# EAGLE design capacitor-tester_v0.0.1 (EAGLE 9.6.0)
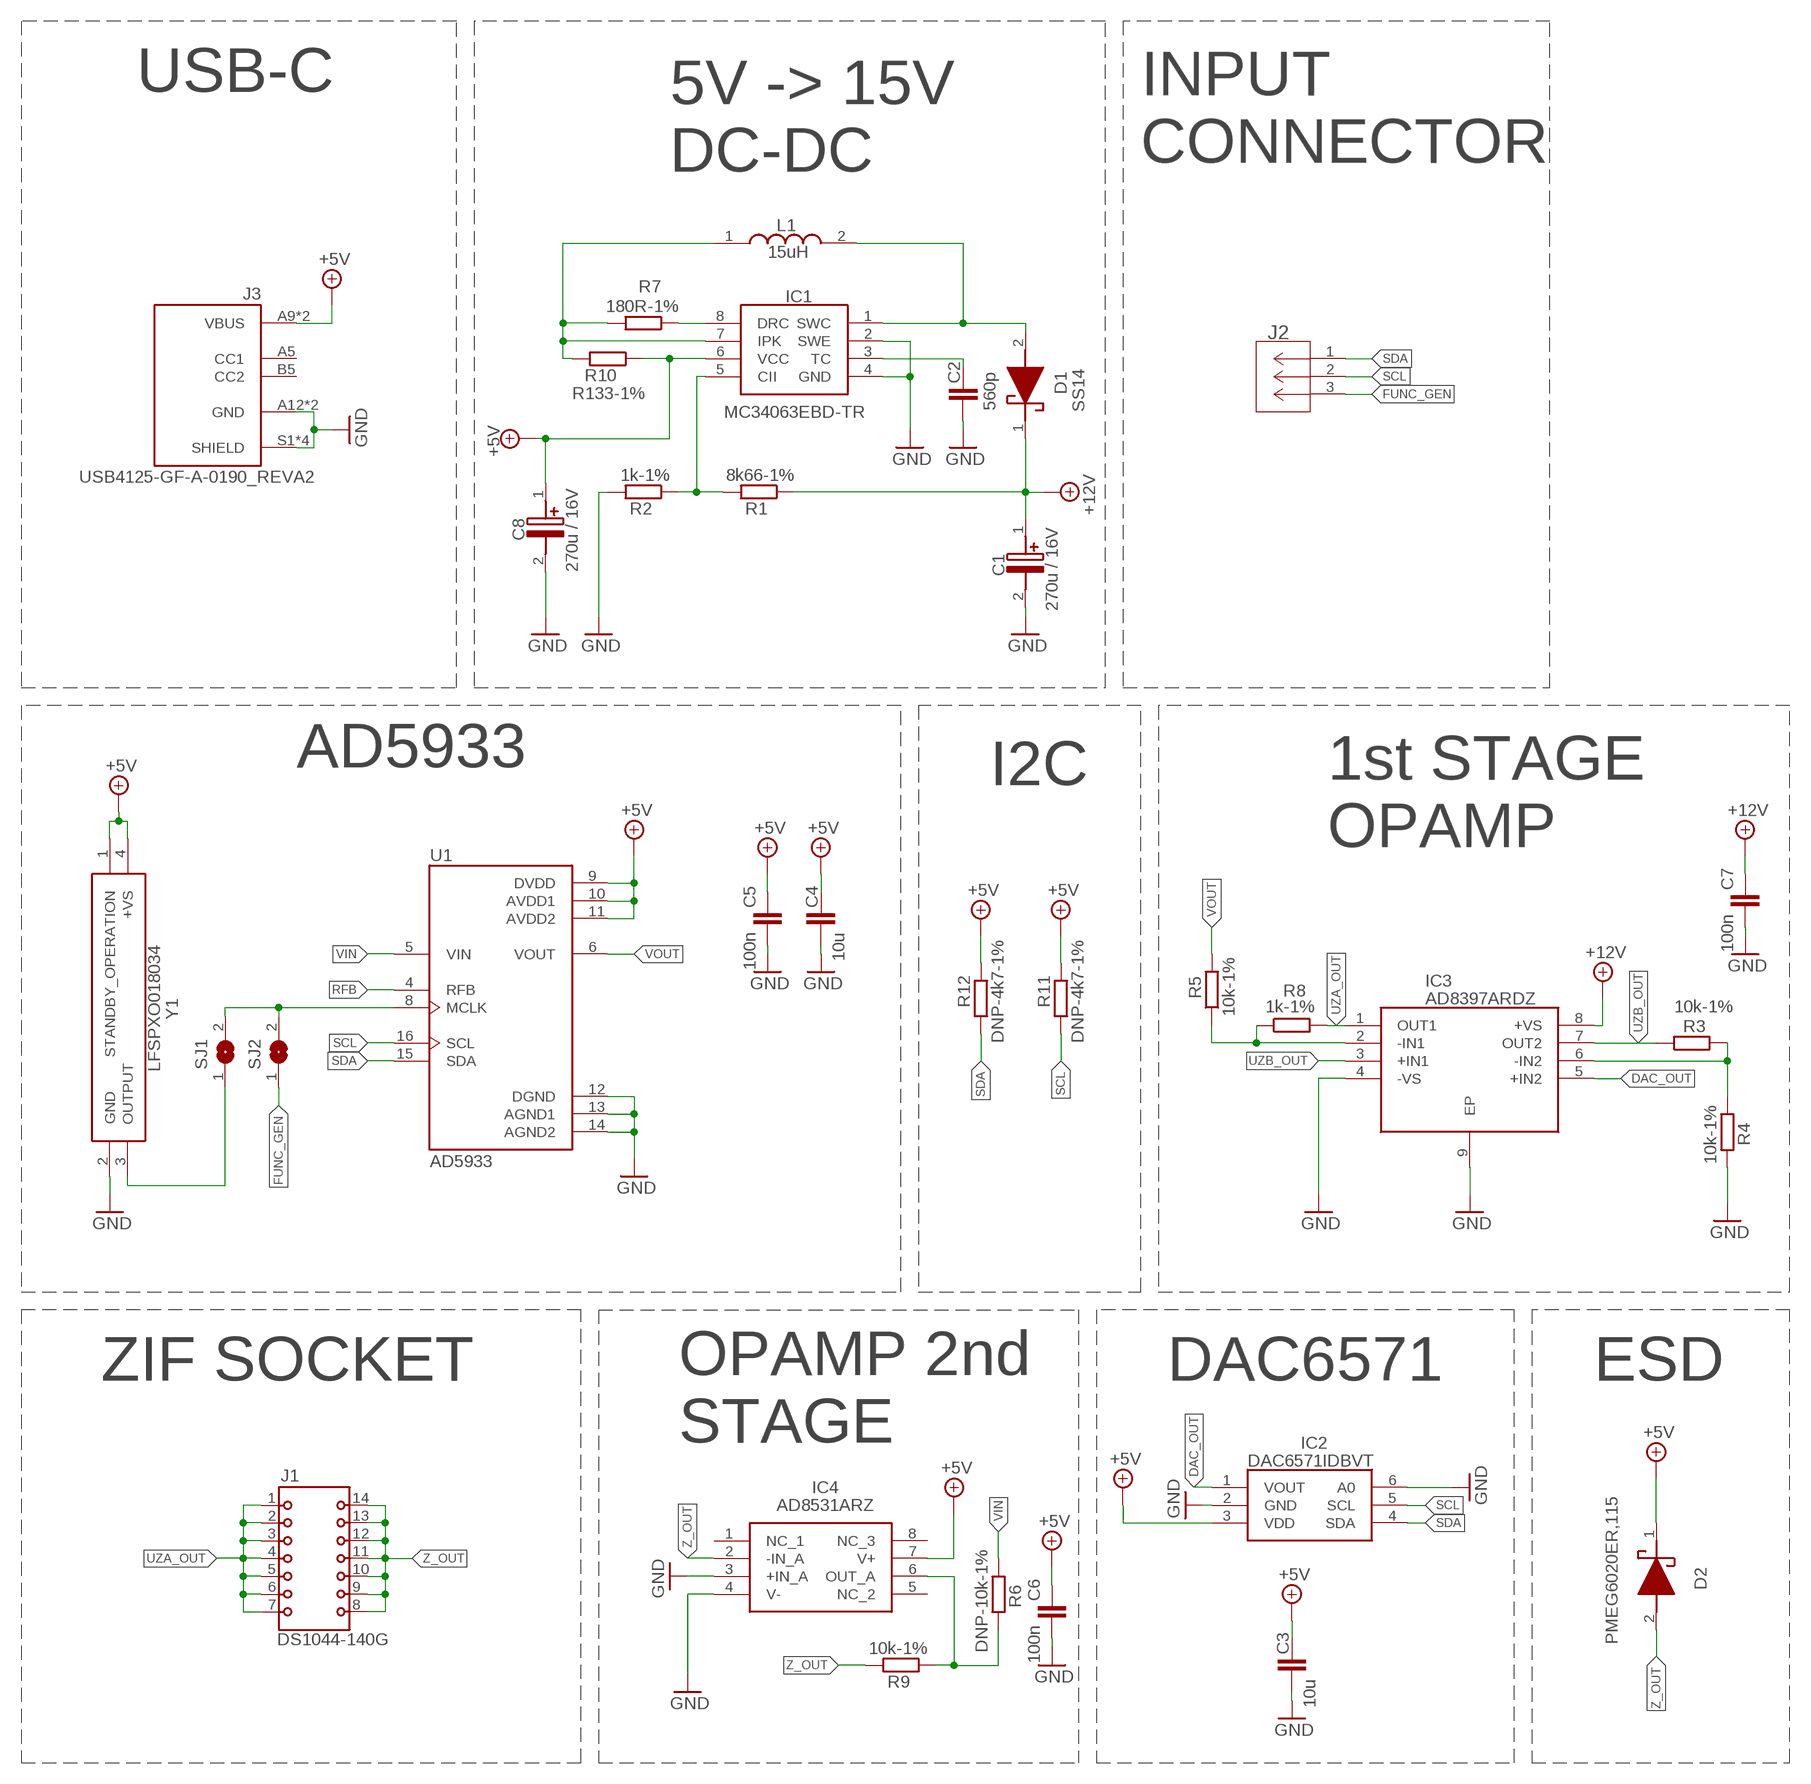
[diagram p0: schematic, sheet 1]

## Parts
C1  270u / 16V  EEEFKC271XSP  [EEE0JA331XP]
C2  560p  CAPACITOR_SMD_CERAMIC0603  [C0603]
C3  10u  CAPACITOR_SMD_CERAMIC0603  [C0603]
C4  10u  CAPACITOR_SMD_CERAMIC0603  [C0603]
C5  100n  CAPACITOR_SMD_CERAMIC0603  [C0603]
C6  100n  CAPACITOR_SMD_CERAMIC0603  [C0603]
C7  100n  CAPACITOR_SMD_CERAMIC0603  [C0603]
C8  270u / 16V  EEEFKC271XSP  [EEE0JA331XP]
D1  SS14  [DIOM5227X270N]
D2  PMEG6020ER,115  [PMEG6020ER115]
IC1  MC34063EBD-TR  [SOIC127P600X175-8N]
IC2  DAC6571IDBVT  [SOT95P280X145-6N]
IC3  AD8397ARDZ  [SOIC127P600X175-9N]
IC4  AD8531ARZ  [SOIC127P600X175-8N]
J1  DS1044-140G  [CONNFLY_DS1044-140G]
J2  250-103  [CONN3_250-103_WAG]
J3  USB4125-GF-A-0190_REVA2  [GCT_USB4125-GF-A-0190_REVA2]
L1  15uH  SDR0604-150YL  [SDR0604330KL]
R1  8k66-1%  RESISTOR_SMD0603  [R0603]
R2  1k-1%  RESISTOR_SMD0603  [R0603]
R3  10k-1%  RESISTOR_SMD0603  [R0603]
R4  10k-1%  RESISTOR_SMD0603  [R0603]
R5  10k-1%  RESISTOR_SMD0603  [R0603]
R6  DNP-10k-1%  RESISTOR_SMD0603  [R0603]
R7  180R-1%  RESISTOR_SMD0603  [R0603]
R8  1k-1%  RESISTOR_SMD0603  [R0603]
R9  10k-1%  RESISTOR_SMD0603  [R0603]
R10  R133-1%  RESISTOR_SMD0603  [R0603]
R11  DNP-4k7-1%  RESISTOR_SMD0603  [R0603]
R12  DNP-4k7-1%  RESISTOR_SMD0603  [R0603]
SJ1  SJW  [SJW]
SJ2  SJW  [SJW]
U1  AD5933  [SOP65P780X200-16N]
Y1  LFSPXO018034  [LFSPXO018034]

## Nets
+5V: C3.1 C4.1 C5.1 C6.1 C8.1(+) D2.1(K) IC1.6(VCC) IC2.3(VDD) IC4.7(V+) J3.A9(VBUS) J3.B9(VBUS) R10.1 R11.2 R12.2 U1.9(DVDD) U1.10(AVDD1) U1.11(AVDD2) Y1.1(STANDBY_OPERATION) Y1.4(+VS)
+12V: C1.1(+) C7.1 D1.1(K) IC3.8(+VS) R1.1
DAC_OUT: IC2.1(VOUT) IC3.5(+IN2)
FUNC_GEN: J2.3 SJ2.1
GND: C1.2(-) C2.2 C3.2 C4.2 C5.2 C6.2 C7.2 C8.2(-) IC1.2(SWE) IC1.4(GND) IC2.2(GND) IC2.6(A0) IC3.4(-VS) IC3.9(EP) IC4.3(+IN_A) IC4.4(V-) J3.A12(GND) J3.B12(GND) J3.S1(SHIELD) J3.S2(SHIELD) J3.S3(SHIELD) J3.S4(SHIELD) R2.2 R4.2 U1.12(DGND) U1.13(AGND1) U1.14(AGND2) Y1.2(GND)
MCLK: SJ1.1 Y1.3(OUTPUT)
N$1: IC4.6(OUT_A) R6.2 R9.1
N$4: IC3.2(-IN1) R5.1 R8.1
N$5: D1.2(A) IC1.1(SWC) L1.2
N$6: SJ1.2 SJ2.2 U1.8(MCLK)
N$7: IC1.5(CII) R1.2 R2.1
N$8: IC1.8(DRC) R7.1
N$10: C2.1 IC1.3(TC)
N$11: IC1.7(IPK) L1.1 R7.2 R10.2
N$13: IC3.6(-IN2) R3.2 R4.1
RFB: U1.4(RFB)
SCL: IC2.5(SCL) J2.2 R11.1 U1.16(SCL)
SDA: IC2.4(SDA) J2.1 R12.1 U1.15(SDA)
UZA_OUT: IC3.1(OUT1) J1.1 J1.2 J1.3 J1.4 J1.5 J1.6 J1.7 R8.2
UZB_OUT: IC3.3(+IN1) IC3.7(OUT2) R3.1
VIN: R6.1 U1.5(VIN)
VOUT: R5.2 U1.6(VOUT)
Z_OUT: D2.2(A) IC4.2(-IN_A) J1.8 J1.9 J1.10 J1.11 J1.12 J1.13 J1.14 R9.2
Unconnected: IC4.1(NC_1) IC4.5(NC_2) IC4.8(NC_3) J3.A5(CC1) J3.B5(CC2)

## Notes on the sheet
- USB-C
- INPUT
  CONNECTOR
- 5V -> 15V 
  DC-DC
- AD5933 | I2C
- 1st STAGE
  OPAMP
- ZIF SOCKET | DAC6571 | ESD
- OPAMP 2nd 
  STAGE

## Library data of the parts
C1 C8 = EEEFKC271XSP:EEEFKC271XSP: Panasonic 270uF 16 V dc Aluminium Electrolytic Capacitor, FKS Series 2000h 6.3 (Dia.) x 7.7mm Source: Datasheet <http://industrial.panasonic.com/cdbs/www-data/pdf/RDE0000/ABA0000C1251.pdf>; DESCRIPTION: Panasonic 270uF 16 V dc Aluminium Electrolytic Capacitor, FKS Series 2000h 6.3 (Dia.) x 7.7mm; HEIGHT: 7.8mm; MANUFACTURER_NAME: Panasonic; MANUFACTURER_PART_NUMBER: EEEFKC271XSP
C2-C7 = custom_library:CAPACITOR_SMD_CERAMIC
D1 = SS14:SS14: High-Current Capability, Low VF; Glass-Passivated Junctions Source: Datasheet <https://www.onsemi.com/pub/Collateral/SS19-D.PDF>; DESCRIPTION: High-Current Capability, Low VF; Glass-Passivated Junctions; HEIGHT: 2.7mm; MANUFACTURER_NAME: onsemi; MANUFACTURER_PART_NUMBER: SS14; MOUSER_PART_NUMBER: 512-SS14; MOUSER_PRICE-STOCK: https://www.mouser.co.uk/ProductDetail/onsemi-Fairchild/SS14?qs=mVVXn4M53U%252BvrBaFv5vr4w%3D%3D
D2 = PMEG6020ER_115:PMEG6020ER,115: Nexperia PMEG6020ER,115 SMT Schottky Diode, 60V 2A, 2-Pin SOD-123W Source: Datasheet <https://assets.nexperia.com/documents/data-sheet/PMEG6020ER.pdf>; DESCRIPTION: Nexperia PMEG6020ER,115 SMT Schottky Diode, 60V 2A, 2-Pin SOD-123W; HEIGHT: 1.1mm; MANUFACTURER_NAME: Nexperia; MANUFACTURER_PART_NUMBER: PMEG6020ER,115
IC1 = MC34063EBD-TR:MC34063EBD-TR: DC-DC Converter Control Circuit SOIC8 STMicroelectronics MC34063EBD-TR, Step Down, Step Up, Voltage Inverting DC-DC Converter, 1.5A, Adjustable Source: Datasheet <https://datasheet.datasheetarchive.com/originals/distributors/Datasheets-5/DSA-98626.pdf>; DESCRIPTION: DC-DC Converter Control Circuit SOIC8 STMicroelectronics MC34063EBD-TR, Step Down, Step Up, Voltage Inverting DC-DC Converter, 1.5A, Adjustable; HEIGHT: 1.75mm; MANUFACTURER_NAME: STMicroelectronics; MANUFACTURER_PART_NUMBER: MC34063EBD-TR
IC2 = DAC6571IDBVT:DAC6571IDBVT: Texas Instruments DAC6571IDBVT, 10 bit Serial DAC, 188ksps, 6-Pin SOT-23 Source: Datasheet <http://www.ti.com/lit/gpn/dac6571>; DESCRIPTION: Texas Instruments DAC6571IDBVT, 10 bit Serial DAC, 188ksps, 6-Pin SOT-23; HEIGHT: 1.45mm; MANUFACTURER_NAME: Texas Instruments; MANUFACTURER_PART_NUMBER: DAC6571IDBVT; MOUSER_PART_NUMBER: 595-DAC6571IDBVT; MOUSER_PRICE-STOCK: https://www.mouser.co.uk/ProductDetail/Texas-Instruments/DAC6571IDBVT?qs=vul0MlC%2Fa1dqpnhoFf%252B88g%3D%3D
IC3 = AD8397ARDZ:AD8397ARDZ: Rail-to-Rail, High Output Current Amplifier Source: Datasheet <https://www.analog.com/AD8397/datasheet>; DESCRIPTION: Rail-to-Rail, High Output Current Amplifier; HEIGHT: 1.75mm; MANUFACTURER_NAME: Analog Devices; MANUFACTURER_PART_NUMBER: AD8397ARDZ; MOUSER_PART_NUMBER: 584-AD8397ARDZ; MOUSER_PRICE-STOCK: https://www.mouser.co.uk/ProductDetail/Analog-Devices/AD8397ARDZ?qs=%2FtpEQrCGXCzWQPMackckTA%3D%3D
IC4 = AD8531ARZ:AD8531ARZ: 250 mA Output, Low Cost, Single-Supply Amplifier Source: Datasheet <https://www.analog.com/AD8531/datasheet>; DESCRIPTION: 250 mA Output, Low Cost, Single-Supply Amplifier; HEIGHT: 1.75mm; MANUFACTURER_NAME: Analog Devices; MANUFACTURER_PART_NUMBER: AD8531ARZ; MOUSER_PART_NUMBER: 584-AD8531ARZ; MOUSER_PRICE-STOCK: https://www.mouser.co.uk/ProductDetail/Analog-Devices/AD8531ARZ?qs=%2FtpEQrCGXCxqCqynf0JWOw%3D%3D
J1 = DS1044-140G:DS1044-140G: Check availability <https://pricing.snapeda.com/parts/DS1044-140G/Connfly/view-part?ref=eda>; AVAILABILITY: Not in stock; CHECK_PRICES: https://www.snapeda.com/parts/DS1044-140G/Connfly/view-part/?ref=eda; DESCRIPTION: Socket: DIP; ZIF; PIN: 14; 7.62mm; demountable; -40÷105°C; THT; 50VDC; MF: Connfly; MP: DS1044-140G; PACKAGE: None; PRICE: None; SNAPEDA_LINK: https://www.snapeda.com/parts/DS1044-140G/Connfly/view-part/?ref=snap
J2 = custom_library:250-103; COPYRIGHT: Copyright (C) 2025 Ultra Librarian. All rights reserved.; MANUFACTURER_PART_NUMBER: 250-103; MFR_NAME: Wago
J3 = USB-C-6Pin:USB4125-GF-A-0190_REVA2: Check availability <https://pricing.snapeda.com/parts/USB4125-GF-A-0190/Global%20Connector%20Technology/view-part?ref=eda>; AVAILABILITY: In Stock; CHECK_PRICES: https://www.snapeda.com/parts/USB4125-GF-A-0190/Global+Connector+Technology/view-part/?ref=eda; DESCRIPTION: USB-C (USB TYPE-C) USB 2.0 Receptacle Connector 24 (6+18 Dummy) Position Surface Mount, Right Angle; Through Hole; MF: Global Connector Technology; MP: USB4125-GF-A-0190; PACKAGE: None; PRICE: None; SNAPEDA_LINK: https://www.snapeda.com/parts/USB4125-GF-A-0190/Global+Connector+Technology/view-part/?ref=snap
L1 = SDR0604-150YL:SDR0604-150YL: Bourns SDR0604 Series Wire-wound SMD Inductor with a Ferrite Core, 15 uH +/-15% 1.6A Idc Q:30 Source: Datasheet <https://www.bourns.com/docs/Product-Datasheets/SDR0604.pdf>; DESCRIPTION: Bourns SDR0604 Series Wire-wound SMD Inductor with a Ferrite Core, 15 uH +/-15% 1.6A Idc Q:30; HEIGHT: 4.8mm; MANUFACTURER_NAME: Bourns; MANUFACTURER_PART_NUMBER: SDR0604-150YL
R1-R12 = custom_library:RESISTOR_SMD
SJ1 SJ2 = jumper:SJ: SMD solder JUMPER
U1 = AD5933:AD5933: Check availability <https://pricing.snapeda.com/parts/AD5933/Analog%20Devices%2C%20Inc./view-part?ref=eda>; AVAILABILITY: Not in stock; CHECK_PRICES: https://www.snapeda.com/parts/AD5933/Analog+Devices/view-part/?ref=eda; DESCRIPTION: Direct Digital Synthesizer 16.776MHz 1-DAC 12bit Serial (I2C) 16-Pin SSOP Tube; MF: Analog Devices, Inc.; MP: AD5933; PACKAGE: SSOP-16 Analog Devices; PRICE: None; SNAPEDA_LINK: https://www.snapeda.com/parts/AD5933/Analog+Devices/view-part/?ref=snap
Y1 = LFSPXO018034:LFSPXO018034: IQD FREQUENCY PRODUCTS - LFSPXO018034 - CRYSTAL OSCILLATOR, SMD, 16MHZ Source: Datasheet <https://www.iqdfrequencyproducts.com/products/pn/LFSPXO018034Bulk.pdf>; DESCRIPTION: IQD FREQUENCY PRODUCTS - LFSPXO018034 - CRYSTAL OSCILLATOR, SMD, 16MHZ; HEIGHT: 1.4mm; MANUFACTURER_NAME: IQD; MANUFACTURER_PART_NUMBER: LFSPXO018034; MOUSER_PART_NUMBER: 449-LFSPXO018034; MOUSER_PRICE-STOCK: https://www.mouser.co.uk/ProductDetail/IQD/LFSPXO018034?qs=ZcfC38r4Povaz%2FiRuMxZiQ%3D%3D

## Board
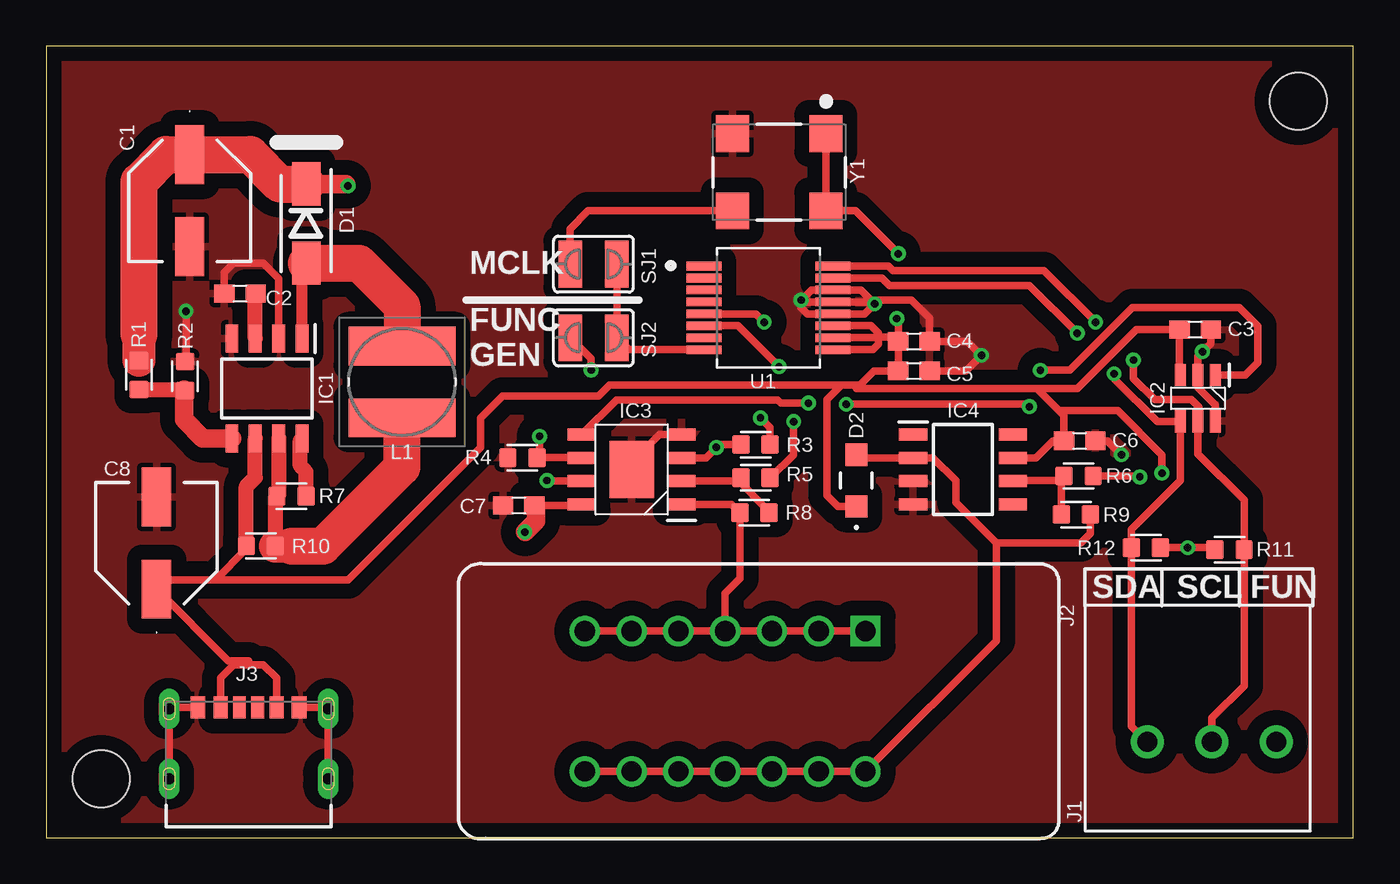
[diagram p1: board, top side]
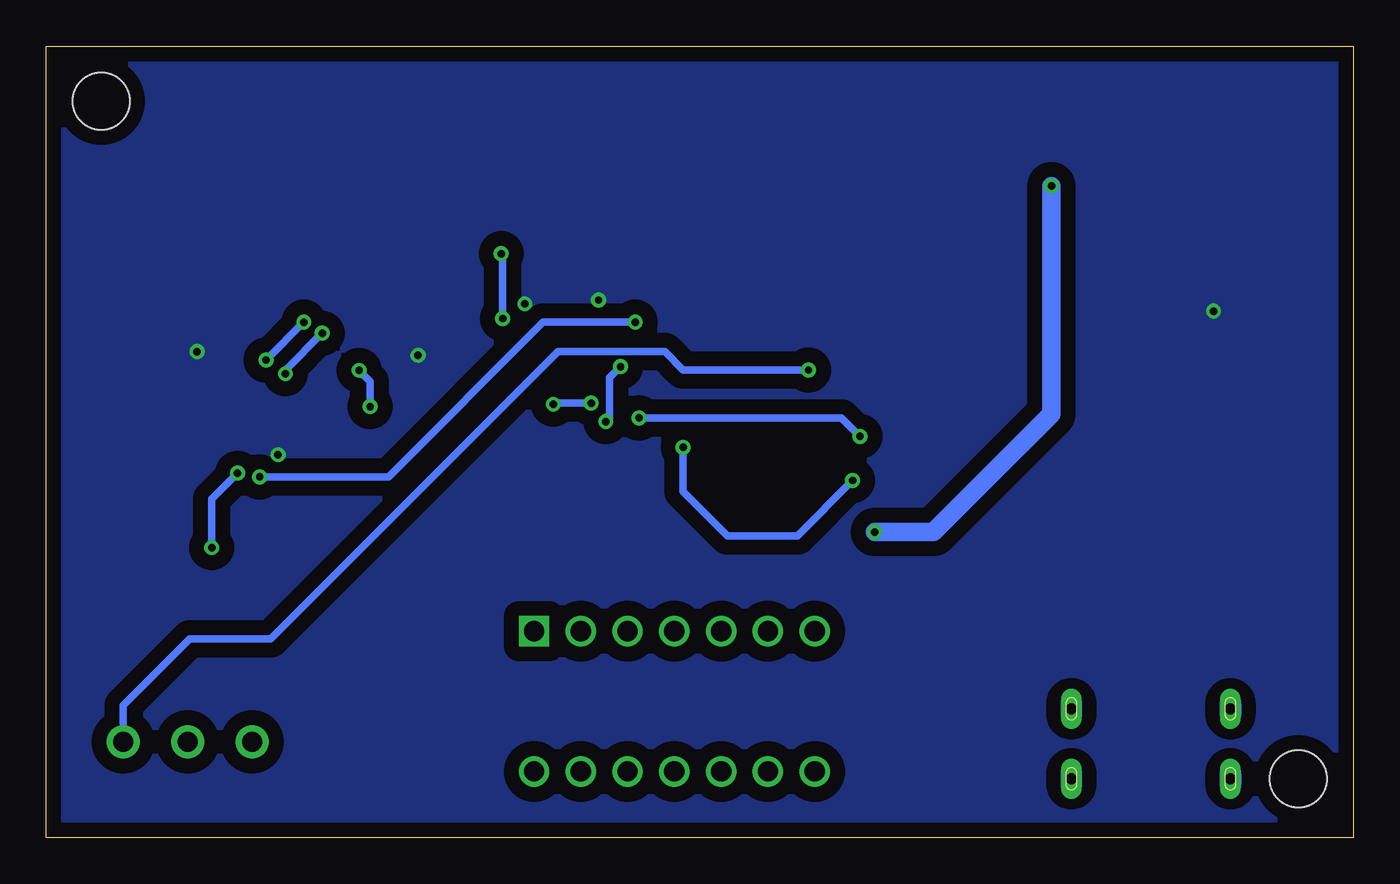
[diagram p2: board, bottom side, seen from below]

Size 71 x 43 mm. Coordinates in mm from the lower left corner, seen from the top.
Outline: 0,0 71,0 71,43 0,43 0,0
Copper layers (1*16): Top 0.035mm / dielectric 1.5mm / Bottom 0.035mm
Design rules "DRC *": minimum track width 0.4mm, minimum drill 0.3mm, track to track 8mil, track to pad 8mil, pad to pad 8mil, via to via 8mil, smd to smd 8mil, copper to edge 20mil, drill to drill 8mil, minimum pad ring 10mil, minimum via ring 8mil, stop-mask expansion 4mil, vias tented up to drill 200mil, thermal gap 10mil
Holes 3.1 mm at 3,3.2 68,40

### Footprints (pad centres in the part's own frame; a part is rotated, then mirrored left to right if it is on the bottom)
EEE0JA331XP = smd 3.2 x 1.6: 1 -2.5,0; 2 2.5,0
C0603 = smd 1.1 x 1: 1 -0.85,0; 2 0.85,0
DIOM5227X270N = smd 2.35 x 1.55: 1 -2.15,0; 2 2.15,0
PMEG6020ER115 = smd 1.2 x 1.2: 1 -1.4,0; 2 1.4,0
SOIC127P600X175-8N = smd 1.525 x 0.7: 1 -2.712,1.905; 2 -2.712,0.635; 3 -2.712,-0.635; 4 -2.712,-1.905; 5 2.712,-1.905; 6 2.712,-0.635; 7 2.712,0.635; 8 2.712,1.905
SOT95P280X145-6N = smd 1.2 x 0.6: 1 -1.25,0.95; 2 -1.25,0; 3 -1.25,-0.95; 4 1.25,-0.95; 5 1.25,0; 6 1.25,0.95
SOIC127P600X175-9N = smd 1.525 x 0.65: 1 -2.712,1.905; 2 -2.712,0.635; 3 -2.712,-0.635; 4 -2.712,-1.905; 5 2.712,-1.905; 6 2.712,-0.635; 7 2.712,0.635; 8 2.712,1.905 | smd 2.41 x 3.098: 9 0,0
SOIC127P600X175-8N' = smd 1.525 x 0.65: 1 -2.712,1.905; 2 -2.712,0.635; 3 -2.712,-0.635; 4 -2.712,-1.905; 5 2.712,-1.905; 6 2.712,-0.635; 7 2.712,0.635; 8 2.712,1.905
CONNFLY_DS1044-140G = drill 1.1 square: 1 -3.81,7.62 | drill 1.1: 2 -3.81,5.08; 3 -3.81,2.54; 4 -3.81,0; 5 -3.81,-2.54; 6 -3.81,-5.08; 7 -3.81,-7.62; 8 3.81,-7.62; 9 3.81,-5.08; 10 3.81,-2.54; 11 3.81,0; 12 3.81,2.54; 13 3.81,5.08; 14 3.81,7.62
CONN3_250-103_WAG = drill 1.092 pad 1.803: 1 0,0; 2 3.505,0; 3 7.01,0
GCT_USB4125-GF-A-0190_REVA2 = smd 0.7 x 1.2: A5 -0.5,3.08; B5 0.5,3.08 | smd 0.76 x 1.2: A9 1.52,3.08; B9 -1.52,3.08 | smd 0.8 x 1.2: A12 2.75,3.08; B12 -2.75,3.08 | drill 0.6 pad 0.8 long: S1 -4.32,3; S2 4.32,3; S3 -4.32,-0.8; S4 4.32,-0.8
SDR0604330KL = smd 5.8 x 2.1: 1 0,-1.95; 2 0,1.95
R0603 = smd 0.94 x 1.02: 1 -0.79,0; 2 0.79,0
SJW = smd 1.27 x 2.54: 1 -1.27,0; 2 1.27,0
SOP65P780X200-16N = smd 1.9 x 0.48: 1 -3.505,2.275; 2 -3.505,1.625; 3 -3.505,0.975; 4 -3.505,0.325; 5 -3.505,-0.325; 6 -3.505,-0.975; 7 -3.505,-1.625; 8 -3.505,-2.275; 9 3.505,-2.275; 10 3.505,-1.625; 11 3.505,-0.975; 12 3.505,-0.325; 13 3.505,0.325; 14 3.505,0.975; 15 3.505,1.625; 16 3.505,2.275
LFSPXO018034 = smd 1.8 x 2: 1 -2.54,-2.1; 2 2.54,-2.1; 3 2.54,2.1; 4 -2.54,2.1

### Placement (x,y rotation side)
C1  7.8,34.6 270 top
C2  10.53,29.55 180 top
C3  62.4,27.6 0 top
C4  47.13,26.95 0 top
C5  47.13,25.35 0 top
C6  56.13,21.55 0 top
C7  25.67,18.05 180 top
C8  6,16 90 top
D1  14.13,33.35 270 top
D2  44,19.4 90 top
IC1  12,24.4 270 top
IC2  62.55,23.87 270 top
IC3  31.8,20 180 top
IC4  AD8531ARZ  [SOIC127P600X175-8N']  49.8,20 0 top
J1  36.88,7.41 270 top
J2  59.8,5.2 0 top
J3  11,4 0 top
L1  19.33,24.75 0 top
R1  5.05,25.13 270 top
R2  7.55,25.07 90 top
R3  38.53,21.35 0 top
R4  25.87,20.65 180 top
R5  38.53,19.55 0 top
R6  56.07,19.65 180 top
R7  13.33,18.55 180 top
R8  38.47,17.65 180 top
R9  55.93,17.55 0 top
R10  11.67,15.85 0 top
R11  64.27,15.65 180 top
R12  59.73,15.75 0 top
SJ1  29.73,31.15 0 top
SJ2  29.73,27.15 0 top
U1  39.23,28.78 0 top
Y1  39.81,36.15 180 top

### Tracks (layer width: path | path; a pad name or v marks a point on that pad's centre or on a via)
+5V  (via drill 0.4 pad 0.5)
  Top 0.4: R12.2 v62,15.75 63.48,15.75 R11.2
  Top 0.406: J3.B9 9.48,8.68 10.2,9.4 10.8,9.4 | J3.A9 12.52,8.68 11.8,9.4 10.8,9.4 | 10.8,9.4 11,9.6 9.9,9.6 C8.1 6.5,14 9.2,14 | 9.2,14 10.88,15.68 R10.1 | Y1.1 Y1.4 43.95,34.05 v46.28,31.72 | 9.2,14 16.4,14 23.6,21.2 23.6,22.8 24.8,24 30,24 30.6,24.6 43.2,24.6 | 43.2,24.6 44.2,24.6 | 44.2,24.6 44,24.4 53.8,24.4 | 44.2,24.6 44.95,25.35 C5.1 C4.1 | U1.9 44.9,26.5 45.2,26.8 45.2,27.2 | 45.2,27.2 46.03,27.2 C4.1 | 45.2,27.2 45.2,27.4 44.8,27.8 U1.11 | U1.10 45.15,27.15 45.2,27.2 | IC4.7 53.76,20.64 54.68,21.55 C6.1 55.28,22.92 55,23.2 | IC2.3 61.55,25.17 C3.1 59.2,27.6 56,24.4 53.8,24.4 | D2.1 43,18 42.4,18.6 42.4,23.8 43.2,24.6 | 53.8,24.4 55,23.2 | C4.1 46.28,28.12 v46.2,28.2 | 55,23.2 58.2,23.2 60.6,20.8 v60.6,19.8
  Top 0.813: R10.1 10.88,19.08 11.37,19.57 IC1.6
  Bottom 0.4: v60.6,19.8 62,18.4 v62,15.75
  Bottom 0.406: v46.2,28.2 46.2,31.64 v46.28,31.72
+12V  (via drill 0.4 pad 0.5)
  Top 0.406: 26.6,17.93 26.52,18.01 C7.1 29.04,18.05 IC3.8 | 16.3,35.5 v16.4,35.4
  Top 1.016: 26.6,17.93 26.6,17.2 v26,16.6 | D1.1 16.3,35.5
  Top 1.8: R1.1 5.05,27.35
  Top 2: D1.1 12.7,35.5 11.1,37.1 C1.1 6.5,37.1 5.05,35.65 5.05,27.35
  Bottom 1.016: v26,16.6 22.8,16.6 16.4,23 v16.4,35.4
DAC_OUT  (via drill 0.4 pad 0.5)
  Top 0.406: v41.4,23.6 39.91,23.6 39.73,23.79 30.97,23.79 IC3.5 | v43.45,23.55 53.27,23.55 v53.4,23.41 | v54,25.39 54.02,25.4 55.6,25.4 59,28.8 64.8,28.8 65.8,27.8 65.8,25.8 65.12,25.12 IC2.1
  Bottom 0.406: v41.4,23.6 43.4,23.6 v43.45,23.55 | v53.4,23.41 53.4,24.79 v54,25.39
FUNC_GEN  (via drill 0.4 pad 0.5)
  Top 0.406: SJ2.1 29.6,26.02 v29.6,25.4
  Bottom 0.406: v29.6,25.4 36.4,25.4 37.4,26.4 43.2,26.4 58.8,10.8 63.2,10.8 66.81,7.19 J2.3
GND  (via drill 0.4 pad 0.5)
  Top 0.406: C5.2 49.95,25.35 v50.8,26.2 50.05,26.95 C4.2 47.98,28.22 47,29.2 45.2,29.2 v45,29 | v45,29 44.45,28.45 U1.12 41.35,28.45 41,28.8 41,29 | 44.9,29.1 U1.13 41.1,29.1 41,29 | 44.9,29.1 v45,29 | 44.9,29.1 44.25,29.75 U1.14 41.55,29.75 v41,29.2 41,29 | C6.2 57.65,21.55 v58.4,20.8 | C3.2 63.25,26.85 v62.8,26.4 62.55,26.15 IC2.2 62.55,24.45 63.5,23.5 IC2.6 | IC3.9 31.8,20.4 33.3,21.91 IC3.4 | IC1.2 12.63,30.36 11.8,31.2 10.2,31.2 9.68,30.68 C2.2 | J3.S3 J3.S1 6.76,7.08 J3.B12 | J3.A12 15.24,7.08 J3.S2 J3.S4 | R2.2 7.6,25.91 v7.6,28.6
  pour Top (isolate 0.813): -2.2,45 -2.2,-3.6 73,-3.6 73,45
  pour Bottom (isolate 0.813): -4.2,47.4 74.4,47.4 74.4,-6.8 -4.2,-6.8
MCLK
  Top 0.406: SJ1.1 28.46,33.06 29.45,34.05 Y1.3
N$1
  Top 0.406: R9.1 55.14,19.51 | 55.14,19.51 R6.2 | IC4.6 52.55,19.4 55.03,19.4 55.14,19.51
N$4
  Top 0.406: IC3.2 37.55,19.36 R5.1 37.74,19.26 39,18 39,17.91 R8.1
N$5
  Top 0.61: IC1.1 13.9,30.98 D1.2
  Top 2: D1.2 17,31.2 19.33,28.87 L1.2
N$6
  Top 0.406: U1.8 31.65,26.5 SJ2.2 SJ1.2
N$7
  Top 0.61: 7.49,24.34 R2.1
  Top 0.813: R1.2 7.49,24.34
  Top 1.016: IC1.5 8.51,21.69 7.49,22.71 7.49,24.34
N$8
  Top 0.406: 13.8,21.58 IC1.8
  Top 0.813: R7.1 14.12,19.88 13.8,20.2 13.8,21.58
N$10
  Top 0.813: IC1.3 11.37,29.54 C2.1
N$11
  Top 0.406: 12.46,18.47 R7.2 12.63,18.65
  Top 0.813: R10.2 12.46,18.47 | IC1.7 12.63,18.65
  Top 1.8: R10.2 13.35,15.85
  Top 2: 13.35,15.85 15.05,15.85 19.33,20.13 L1.1
N$13  (via drill 0.4 pad 0.5)
  Top 0.406: IC3.6 29.08,20.65 R4.1 26.8,20.79 v26.8,21.8 | R3.2 39.32,22.28 v38.8,22.8
  Bottom 0.406: v38.8,22.8 27.8,22.8 v26.8,21.8
SCL  (via drill 0.4 pad 0.5)
  Top 0.4: IC2.5 62.55,20.85 65.06,18.34 R11.1
  Top 0.406: U1.16 45.75,31.05 46,30.8 54.2,30.8 v57,28 | v59.05,25.95 59.05,24.95 60.2,23.8 62.2,23.8 62.6,23.4 62.6,22.66 IC2.5 | R11.1 65.06,8.26 63.3,6.5 J2.2
  Bottom 0.406: v57,28 v59.05,25.95
SDA  (via drill 0.4 pad 0.5)
  Top 0.4: R12.1 58.94,16.74 61.6,19.4 61.6,22.6
  Top 0.406: IC2.4 61.6,22.6 60.34,22.6 58.05,24.89 58.05,25.16 v58,25.2 | U1.15 45.4,30.4 45.8,30 53.4,30 v56,27.4 | J2.1 58.94,6.06 R12.1
  Bottom 0.406: v56,27.4 58,25.4 v58,25.2
UZA_OUT
  Top 0.406: IC3.1 37.23,18.09 R8.2 37.68,14.08 36.88,13.28 J1.4 | J1.7 J1.6 J1.5 J1.4 | J1.4 J1.3 J1.2 J1.1
UZB_OUT  (via drill 0.4 pad 0.5)
  Top 0.406: IC3.3 35.84,20.64 v36.4,21.2 36.55,21.35 R3.1 | IC3.7 27.23,19.36 v27.2,19.4
  Bottom 0.406: v27.2,19.4 30.2,16.4 34,16.4 36.4,18.8 v36.4,21.2
VIN  (via drill 0.4 pad 0.5)
  Top 0.406: R6.1 59.35,19.65 v59.4,19.6 | U1.5 38.55,28.45 v39,28
  Bottom 0.406: v39,28 44,28 52.4,19.6 v59.4,19.6
VOUT  (via drill 0.4 pad 0.5)
  Top 0.406: U1.6 37.58,27.8 v39.8,25.59 | v40.6,22.6 40.6,20.8 39.35,19.55 R5.2
  Bottom 0.406: v39.8,25.59 40.4,24.98 40.4,22.8 v40.6,22.6
Z_OUT
  Top 0.406: J1.8 J1.9 J1.10 J1.11 J1.12 J1.13 J1.14 51.6,10.7 51.6,16 | D2.2 44.44,20.64 IC4.2 48.16,20.64 49.4,19.4 49.4,18.2 51.6,16 | R9.2 56.72,16.52 56.2,16 51.6,16

### Text on the board
tPlace: MCLK | FUNC / GEN | SDA | SCL | FUN